# EAGLE design transmitter schematic (EAGLE 9.6.2)
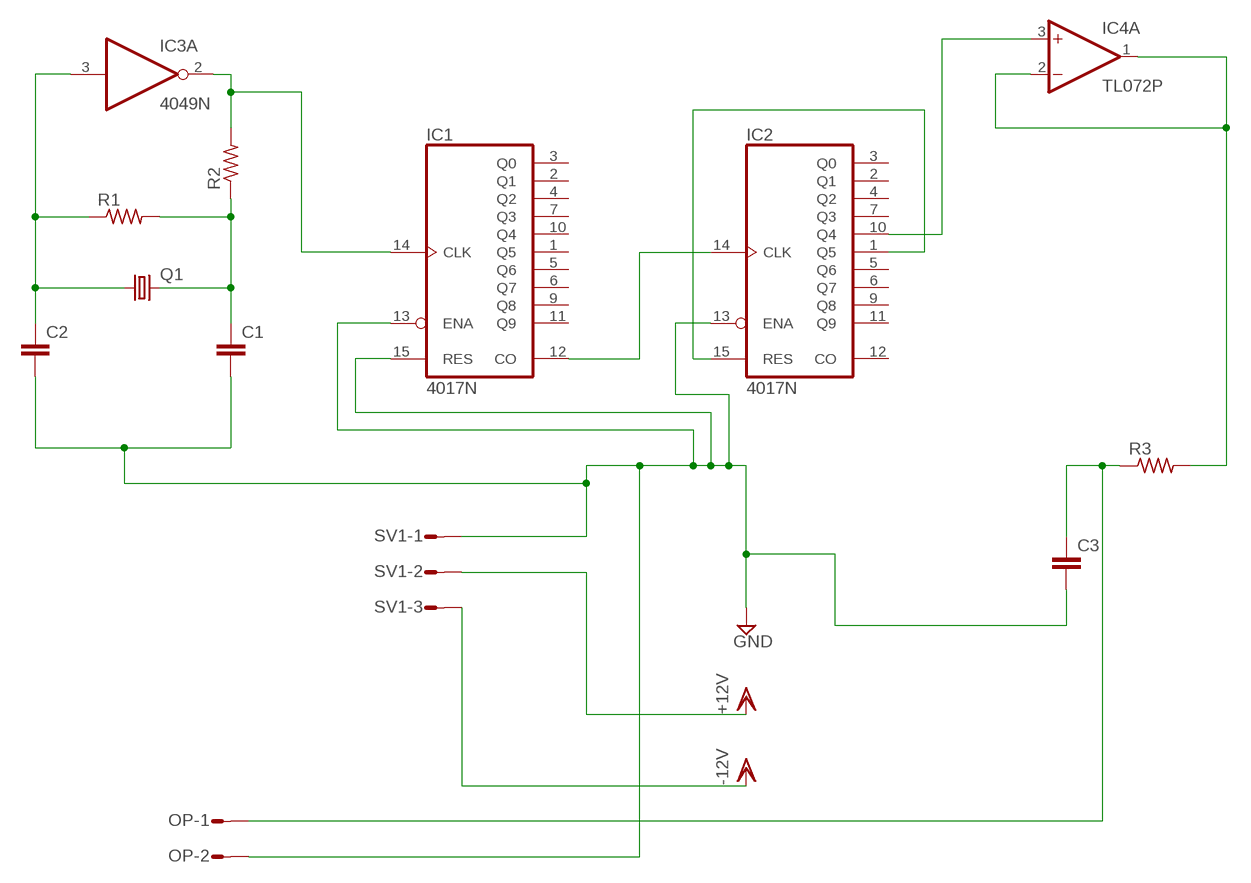
[diagram p0: schematic, sheet 1]

## Parts
C1  C5/3.5  [C5B3.5]
C2  C5/3.5  [C5B3.5]
C3  C5/3.5  [C5B3.5]
IC1  4017N  [DIL16]
IC2  4017N  [DIL16]
IC3  4049N  [DIL16]
IC4  TL072P  [DIL08]
OP  L02P  [L02P]
Q1  CRYSTALHC49U-V  [HC49U-V]
R1  R-US_0207/12  [0207/12]
R2  R-US_0207/12  [0207/12]
R3  R-US_0207/12  [0207/12]
SV1  L03P  [L03P]

## Nets
N$1: IC1.12(CO) IC2.14(CLK)
N$2: C3.1 OP.1 R3.1
N$4: C1.2 C2.2 C3.2 IC1.13(ENA) IC1.15(RES) IC2.13(ENA) OP.2 SV1.1 ; supply symbol labelled GND
N$5: IC1.14(CLK) IC3.2(A:O) R2.2
N$6: IC2.1(Q5) IC2.15(RES)
N$7: C2.1 IC3.3(A:I) Q1.1 R1.1
N$8: IC4.1(A:OUT) IC4.2(A:-IN) R3.2
N$9: C1.1 Q1.2 R1.2 R2.1
N$14: IC2.10(Q4) IC4.3(A:+IN)
VDD: SV1.2 SV1.3 ; supply symbol labelled +12V, -12V
Unconnected: IC1.1(Q5) IC1.2(Q1) IC1.3(Q0) IC1.4(Q2) IC1.5(Q6) IC1.6(Q7) IC1.7(Q3) IC1.9(Q8) IC1.10(Q4) IC1.11(Q9) IC2.2(Q1) IC2.3(Q0) IC2.4(Q2) IC2.5(Q6) IC2.6(Q7) IC2.7(Q3) IC2.9(Q8) IC2.11(Q9) IC2.12(CO) IC3.4(B:O) IC3.5(B:I) IC3.6(C:O) IC3.7(C:I) IC3.9(D:I) IC3.10(D:O) IC3.11(E:I) IC3.12(E:O) IC3.14(F:I) IC3.15(F:O) IC4.5(B:+IN) IC4.6(B:-IN) IC4.7(B:OUT)

## Power pins joined to a net without a drawn wire
V+: IC4.8(P:V+)
V-: IC4.4(P:V-)
VDD: IC1.16(VDD) IC2.16(VDD) IC3.1(P:VDD)
VSS: IC1.8(VSS) IC2.8(VSS) IC3.8(P:VSS)

## Library data of the parts
C1-C3 = capacitor-wima:C: CAPACITOR naming: grid - package width
IC1 IC2 = 40xx:4017: COUNTER/DIVIDER
IC3 = 40xx:4049: Hex inverting BUFFER
IC4 = linear:TL072: OP AMP
OP = con-amp-mt:L02P: AMP MT CONNECTOR; OC_FARNELL: unknown; OC_NEWARK: unknown
Q1 = crystal:CRYSTAL: CRYSTAL; OC_FARNELL: 1666969; OC_NEWARK: unknown
R1-R3 = rcl:R-US_: RESISTOR, American symbol; SPICEPREFIX: R
SV1 = con-amp-mt:L03P: AMP MT CONNECTOR; OC_FARNELL: unknown; OC_NEWARK: unknown

## Board
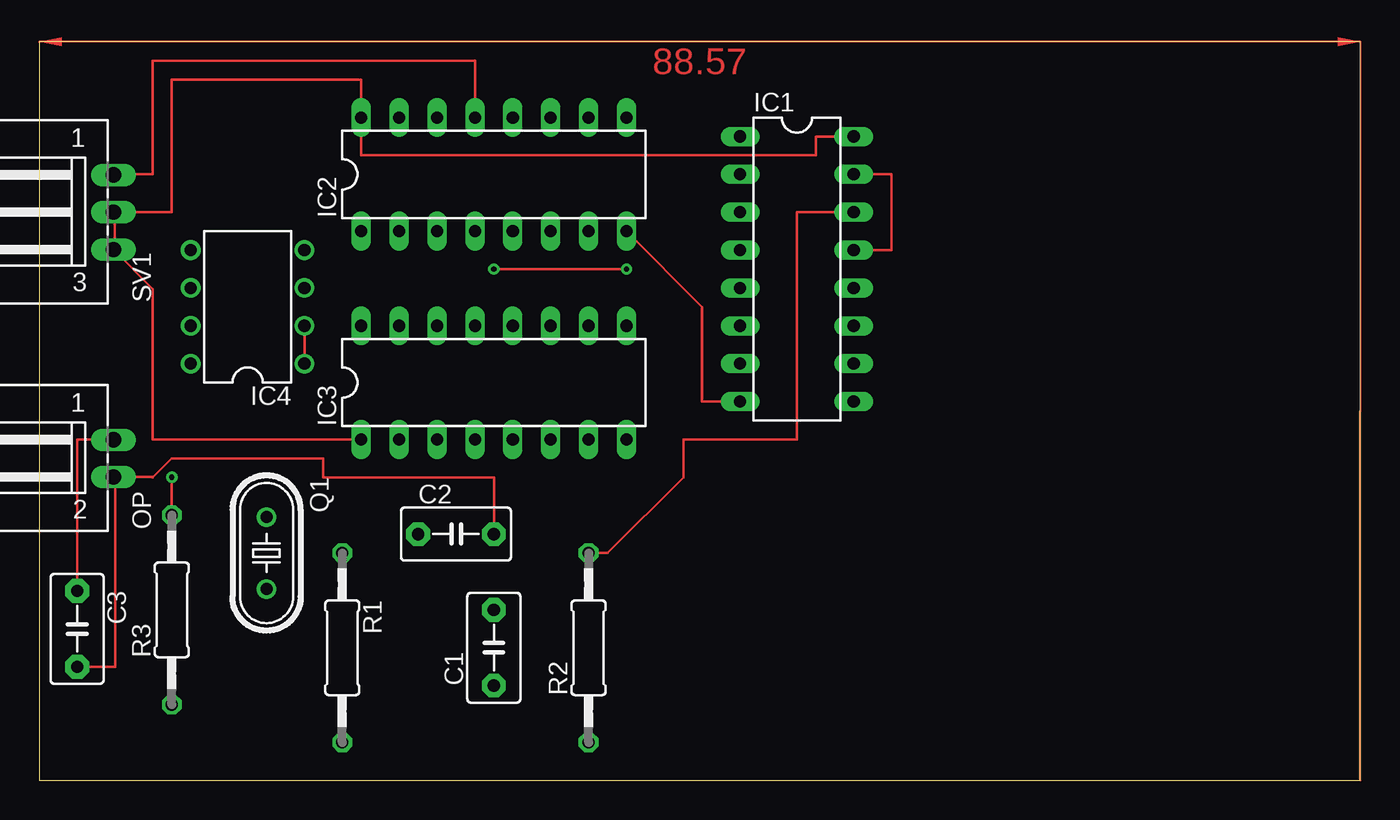
[diagram p1: board, top side]
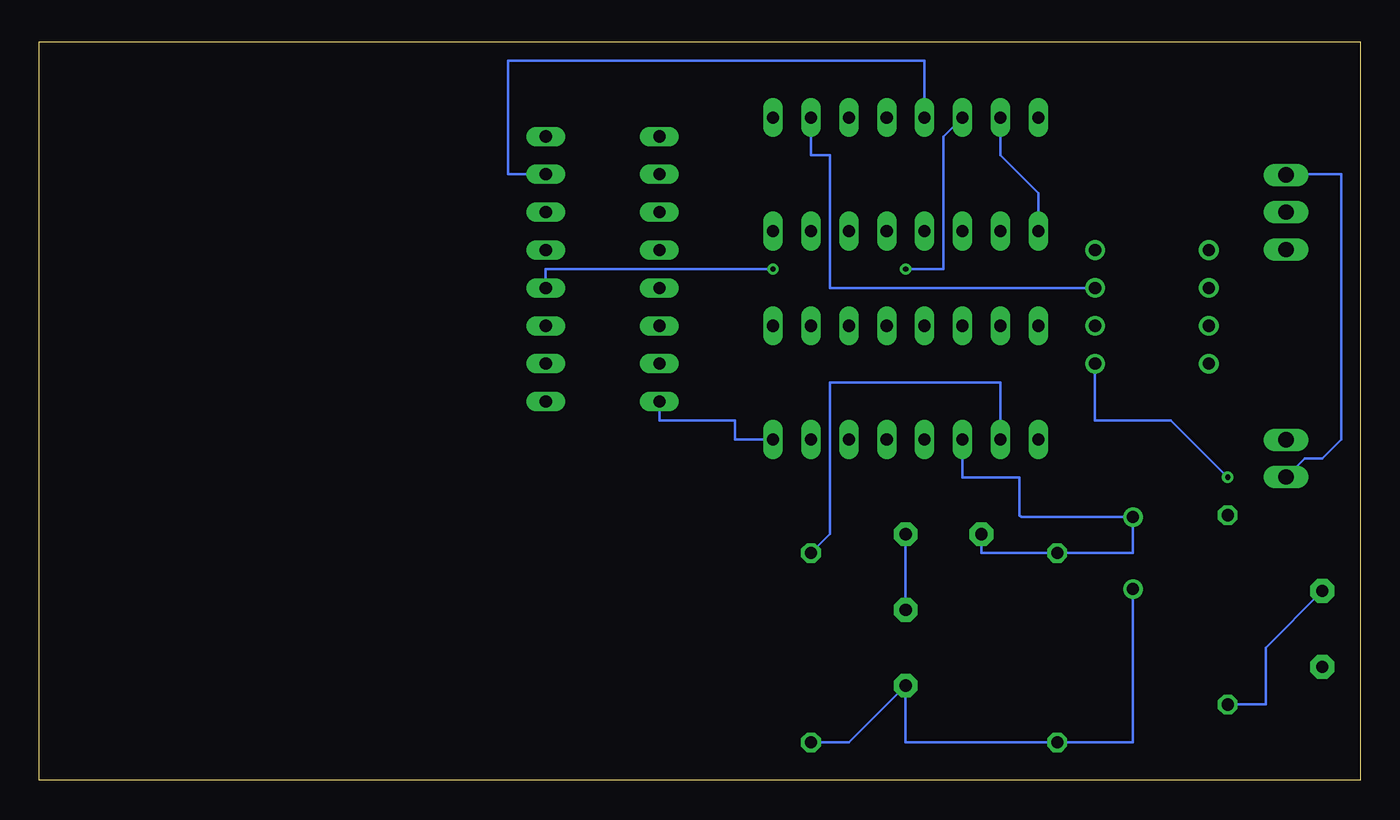
[diagram p2: board, bottom side, seen from below]

Size 88.57 x 49.52 mm. Coordinates in mm from the lower left corner, seen from the top.
Outline: 0,0 88.57,0 88.57,49.52 0,49.52 0,0
Copper layers (1*16): Top 0.035mm / dielectric 1.5mm / Bottom 0.035mm
Design rules "default": minimum track width 6mil, minimum drill 0.35mm, track to track 6mil, track to pad 6mil, pad to pad 6mil, via to via 6mil, smd to smd 6mil, copper to edge 40mil, drill to drill 6mil, minimum pad ring 10mil, minimum via ring 8mil, stop-mask expansion 4mil, vias tented up to drill 0mil, thermal gap 10mil

### Footprints (pad centres in the part's own frame; a part is rotated, then mirrored left to right if it is on the bottom)
C5B3.5 = drill 0.813 pad 1.6 octagon: 1 -2.54,0; 2 2.54,0
DIL16 = drill 0.813 long: 1 -8.89,-3.81; 2 -6.35,-3.81; 3 -3.81,-3.81; 4 -1.27,-3.81; 5 1.27,-3.81; 6 3.81,-3.81; 7 6.35,-3.81; 8 8.89,-3.81; 9 8.89,3.81; 10 6.35,3.81; 11 3.81,3.81; 12 1.27,3.81; 13 -1.27,3.81; 14 -3.81,3.81; 15 -6.35,3.81; 16 -8.89,3.81
DIL08 = drill 0.813 pad 1.27: 1 -3.81,-3.81; 2 -1.27,-3.81; 3 1.27,-3.81; 4 3.81,-3.81; 5 3.81,3.81; 6 1.27,3.81; 7 -1.27,3.81; 8 -3.81,3.81
L02P = drill 1.016 long: 1 1.25,-6.25; 2 -1.25,-6.25
HC49U-V = drill 0.813: 1 -2.413,0; 2 2.413,0
0207/12 = drill 0.813 octagon: 1 -6.35,0; 2 6.35,0
L03P = drill 1.016 long: 1 2.5,-6.25; 2 0,-6.25; 3 -2.5,-6.25

### Placement (x,y rotation side)
C1  30.48,8.89 90 top
C2  27.94,16.51 0 top
C3  2.54,10.16 270 top
IC1  50.8,34.29 270 top
IC2  30.48,40.64 0 top
IC3  30.48,26.67 0 top
IC4  13.97,31.75 90 top
OP  -1.27,21.59 90 top
Q1  15.24,15.24 270 top
R1  20.32,8.89 270 top
R2  36.83,8.89 90 top
R3  8.89,11.43 90 top
SV1  -1.27,38.1 90 top

### Tracks (layer width: path | path; a pad name or v marks a point on that pad's centre or on a via)
N$1  (via drill 0.35)
  Top 0.152: v30.48,34.29 v39.37,34.29
  Bottom 0.152: IC2.14 27.94,43.18 27.94,34.29 v30.48,34.29 | v39.37,34.29 54.61,34.29 IC1.12
N$2
  Top 0.152: OP.1 5,22.86 2.54,22.86 C3.1
  Bottom 0.152: R3.1 6.35,5.08 6.35,8.89 C3.1
N$4
  Top 0.152: C2.2 30.48,20.32 19.05,20.32 19.05,21.59 8.89,21.59 7.62,20.32 7.6,20.34 5.08,20.34 | OP.2 5.08,20.34 | C3.2 5.08,7.62 5.08,20.34 | SV1.1 5.02,40.64 7.62,40.64 7.62,48.26 29.21,48.26 IC2.13 | IC1.15 57.15,40.64 57.15,35.56 IC1.13
  Bottom 0.152: C2.2 C1.2 | OP.2 3.73,21.59 2.54,21.59 1.27,22.86 1.27,40.64 4.94,40.64 SV1.1 | IC2.13 29.21,48.26 57.15,48.26 57.15,40.64 IC1.15
N$5
  Top 0.152: IC1.14 50.8,38.1 50.8,22.86 43.18,22.86 43.18,20.32 38.1,15.24 R2.2
  Bottom 0.152: IC3.2 24.13,26.67 35.56,26.67 35.56,16.51 R2.2
N$6
  Bottom 0.152: IC2.15 24.13,41.91 21.59,39.37 IC2.1
N$7
  Bottom 0.152: IC3.3 26.67,20.32 22.86,20.32 22.86,17.78 22.73,17.65 Q1.1 15.24,15.24 R1.1 25.4,15.24 C2.1
N$8  (via drill 0.35)
  Top 0.152: R3.2 v8.89,20.32 | IC4.1 IC4.2
  Bottom 0.152: v8.89,20.32 12.7,24.13 17.78,24.13 IC4.1
N$9
  Bottom 0.152: Q1.2 15.24,2.54 R1.2 30.48,2.54 C1.1 34.29,2.54 R2.1
N$14
  Bottom 0.152: IC4.3 35.56,33.02 35.56,41.91 36.83,41.91 IC2.10
VDD
  Top 0.152: SV1.3 5.05,35.53 | 5.05,35.53 7.62,32.96 7.62,22.86 IC3.1 | 5.05,35.53 5.05,38.03 SV1.2 8.89,38.1 8.89,46.99 21.59,46.99 IC2.16 21.59,41.91 52.07,41.91 52.07,43.18 IC1.16
VSS
  Top 0.152: IC2.8 44.45,31.75 44.45,25.4 IC1.8
  Bottom 0.152: IC3.8 41.91,22.86 41.91,24.13 46.99,24.13 IC1.8
(copper drawn outside any net)
  shapes: Top area x2